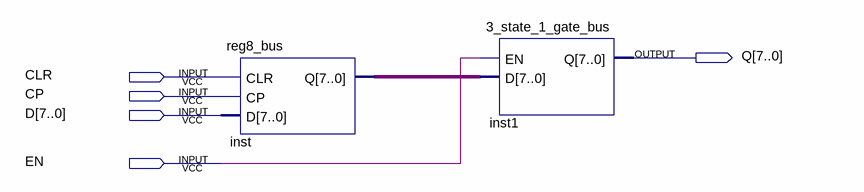
[diagram p0: schematic sheet]
// Quartus schematic reg8_EN_bus.bdf as structural Verilog: 2 symbols, 5 pins
module reg8_EN_bus (
  input  CLR,
  input  CP,
  input  [7:0] D,
  input  EN,
  output [7:0] Q
);

  wire [7:0] inst_q;

  reg8_bus inst (.CLR(CLR), .CP(CP), .D(D), .Q(inst_q));
  \3_state_1_gate_bus  inst1 (.EN(EN), .D(inst_q), .Q(Q));
endmodule
